# Altium schematic sheet ext_supply.SchDoc: foxBMS BMS-Slave 12-Cell
size A3; DocumentNumber: 18; SheetNumber: 18; SheetTotal: 19; AUTHOR: Fraunhofer IISB foxBMS Team; SheetDescription: External Power Supply
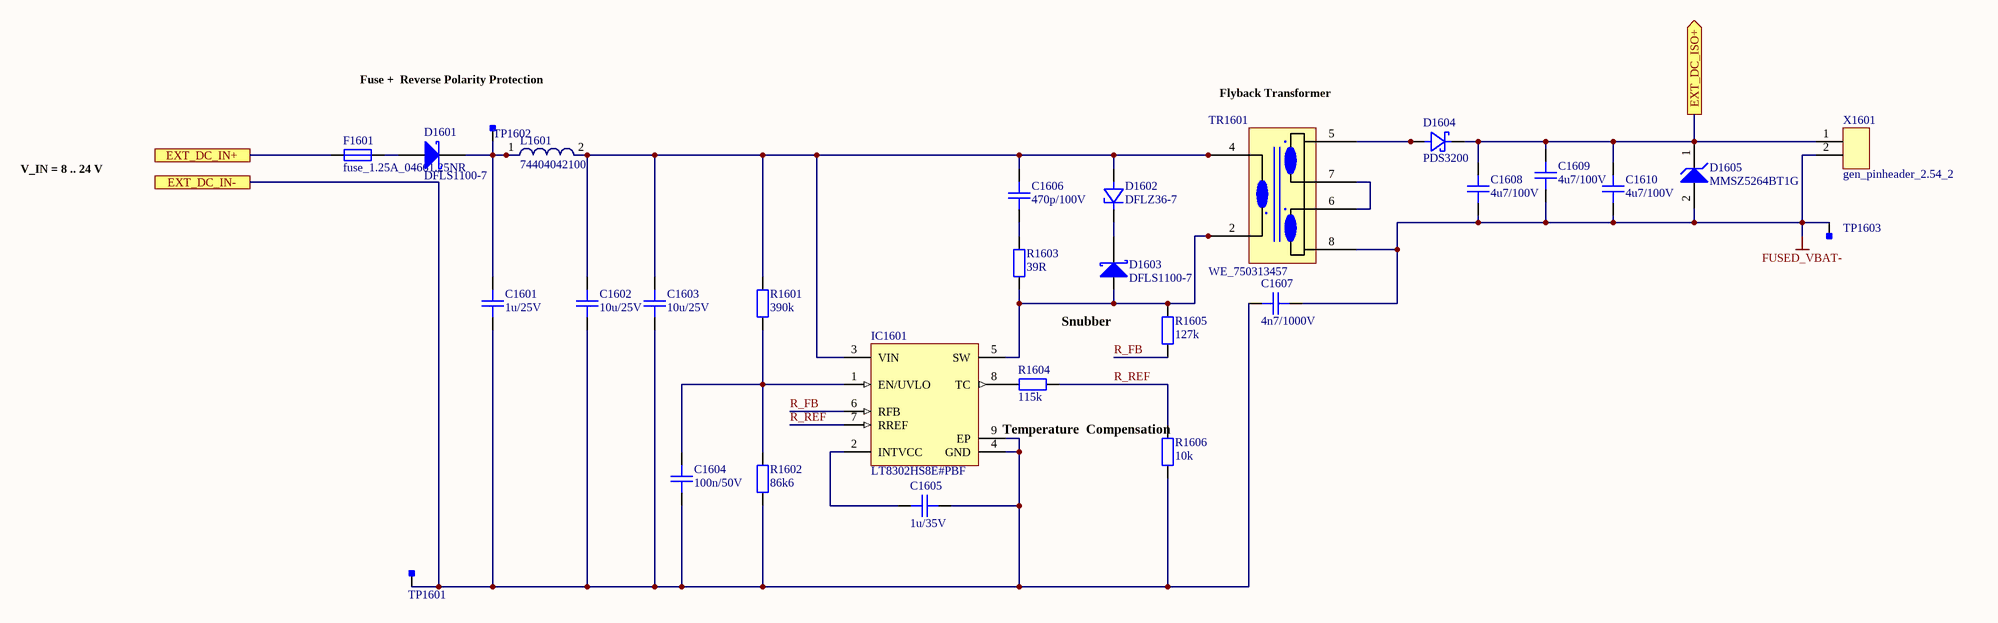
[diagram p0: ext_supply.SchDoc]

## Parts
C1601  1u/25V  [CAPC2012X14N]
C1602  10u/25V  [CAPC3225X25N]
C1603  10u/25V  [CAPC3225X25N]
C1604  100n/50V  [CAPC1608X08N]
C1605  1u/35V  [CAPC1608X08N]
C1606  470p/100V  [CAPC2012X14N]
C1607  4n7/1000V  [CAPC4532X16N]
C1608  4u7/100V  [CAPC3216X18N]
C1609  4u7/100V  [CAPC3216X18N]
C1610  4u7/100V  [CAPC3216X18N]
D1601  DFLS1100-7  [DIOD-POWERDI123-2_V]
D1602  DFLZ36-7  [PowerDI123]
D1603  DFLS1100-7  [DIOD-POWERDI123-2_V]
D1604  PDS3200  [PowerDI5]
D1605  MMSZ5264BT1G  [ONSC-SOD-123-2-425-04_V]
F1601  fuse_1.25A_04661.25NR  [LITTLEFUSE_466]
IC1601  LT8302HS8E#PBF  [LT-S8E-8_V]
L1601  74404042100  [WE-LQS 4018]
R1601  390k  [RESC1608X05N]
R1602  86k6  [RESC1608X05N]
R1603  39R  [RESC2012X05N]
R1604  115k  [RESC1608X05N]
R1605  127k  [RESC1608X05N]
R1606  10k  [RESC1608X05N]
TP1601  Testpoint_Square  [Testpoint_S1]  (value not drawn)  (no BOM)
TP1602  Testpoint_Square  [Testpoint_S1]  (value not drawn)  (no BOM)
TP1603  Testpoint_Square  [Testpoint_S1]  (value not drawn)  (no BOM)
TR1601  WE_750313457  [WE_750313457]
X1601  gen_pinheader_2.54_2  [Pinheader_2.54_2]

## Ports
EXT_DC_IN+, EXT_DC_IN-, EXT_DC_ISO+ (out)

## Nets
FUSED_VBAT-: C1607.2 C1608.1 C1609.1 C1610.1 D1605.2(A) TP1603.1 TR1601.8 X1601.2
EXT_DC_IN+: F1601.1 ; port EXT_DC_IN+
EXT_DC_IN-: C1601.1 C1602.1 C1603.1 C1604.1 C1605.1 C1607.1 IC1601.4(GND) IC1601.9(EP) R1602.1 R1606.1 TP1601.1 ; port EXT_DC_IN-
EXT_DC_ISO+: C1608.2 C1609.2 C1610.2 D1604.1(C) D1605.1(K) X1601.1 ; port EXT_DC_ISO+
R_FB: IC1601.6(RFB) R1605.1
R_REF: IC1601.7(RREF) R1604.2 R1606.2
NetC1601_2: C1601.2 D1601.2(K) L1601.1 TP1602.1
NetC1602_2: C1602.2 C1603.2 C1606.2 D1602.2(A) IC1601.3(VIN) L1601.2 R1601.2 TR1601.3 TR1601.4
NetC1604_2: C1604.2 IC1601.1(EN/UVLO) R1601.1 R1602.2
NetC1605_2: C1605.2 IC1601.2(INTVCC)
NetC1606_1: C1606.1 R1603.2
NetD1601_1: D1601.1(A) F1601.2
NetD1602_1: D1602.1(K) D1603.2(K)
NetD1603_1: D1603.1(A) IC1601.5(SW) R1603.1 R1605.2 TR1601.1 TR1601.2
NetD1604_2: D1604.2(A) D1604.3(A) TR1601.5
NetIC1601_8: IC1601.8(TC) R1604.1
NetTR1601_6: TR1601.6 TR1601.7

## Notes on the sheet
- (near TP1602) Fuse +
  Reverse Polarity Protection
- (near TR1601) Flyback Transformer
- V_IN = 8 .. 24 V
- Snubber
- (near R1606) Temperature
  Compensation
- Fraunhofer IISB
- Schottkystr. 10
- developed by:
- 91058 Erlangen
- Germany
- Author
- Project
- License
- Description
- File
- Version
- Release Date
- Sheet
- www.foxbms.org
- www.iisb.fraunhofer.de
- foxBMS Team
- /

## Library data of the parts
C1601 = gen_C_ceramic_1u_25V_X7R_0805: MLCC; Capacitance: 1u; Rated Voltage: 25V; Dielectric: X7R; Case EIA: 0805; Case Metric: 2012; PnP Package: C_0805_10; PnP Value: 1uF/25V/X7R; PnP equipped: x; Automotive Qualified: False; Part Number: gen_C_ceramic_1u_25V_X7R_0805; Supplier 1: Farnell; Supplier Part Number 1: 2070446
C1602 C1603 = gen_C_ceramic_10u_25V_X7R_1210: MLCC; Capacitance: 10u; Rated Voltage: 25V; Dielectric: X7R; Case EIA: 1210; Case Metric: 3225; AVT Set: x; Automotive Qualified: False; Part Number: gen_C_ceramic_10u_25V_X7R_1210; Supplier 1: Farnell; Supplier Part Number 1: 2070524
C1604 = gen_C_ceramic_100n_50V_X7R_0603: MLCC; Capacitance: 100n; Rated Voltage: 50V; Dielectric: X7R; Case EIA: 0603; Case Metric: 1608; PnP Package: C_0603_10; PnP Value: 100n/50V/X7R; PnP equipped: x; Automotive Qualified: False; Part Number: gen_C_ceramic_100n_50V_X7R_0603; Supplier 1: Farnell; Supplier Part Number 1: 2525267; Supplier 2: Digikey; Supplier Part Number 2: 490-6049-1-ND
C1605 = gen_C_ceramic_1u_35V_X7R_0603: MLCC; Capacitance: 1u; Rated Voltage: 35V; Dielectric: X7R; Case EIA: 0603; Case Metric: 1608; PnP Package: C_0603_10; PnP Value: 1uF/35V/X7R; PnP equipped: x; Automotive Qualified: False; Part Number: gen_C_ceramic_1u_35V_X7R_0603; Supplier 1: Farnell; Supplier Part Number 1: 1907508
C1606 = gen_C_ceramic_470p_100V_X7R_0805: MLCC; Capacitance: 470p; Rated Voltage: 100V; Dielectric: X7R; Case EIA: 0805; Case Metric: 2012; Automotive Qualified: False; Part Number: gen_C_ceramic_470p_100V_X7R_0805; Supplier 1: Farnell; Supplier Part Number 1: 1759283
C1607 = gen_C_ceramic_4n7_1000V_X7R_1812: MLCC; Capacitance: 4n7; Rated Voltage: 1000V; Dielectric: X7R; Case EIA: 1812; Case Metric: 4532; Automotive Qualified: False; Part Number: gen_C_ceramic_4n7_1000V_X7R_1812; Supplier 1: Farnell; Supplier Part Number 1: 1702159
C1608-C1610 = gen_C_ceramic_4u7_100V_X7S_1206: MLCC; Capacitance: 4u7; Rated Voltage: 100V; Dielectric: X7S; Case EIA: 1206; Case Metric: 3216; AVT Set: x; Automotive Qualified: False; Part Number: gen_C_ceramic_4u7_100V_X7S_1206; Supplier 1: Digikey; Supplier Part Number 1: 478-8719-1-ND
D1601 D1603 = CMP-2000-05099-1: 1 A High Voltage Schottky Barrier Rectifier, 0.62 V, -55 to 175 degC, 2- Pin POWERDI123, Pb-Free, Tape and Reel; Manufacturer: Diodes Inc; Average Rectified Current-Max: 1A; Peak Current-Max: 40A; Forward Voltage: 0.77V; Reverse Current-Max: 1µA; Reverse Voltage-Max [Vrrm]: 100V; Datasheet Version: Sep-14; Datasheet URL: https://datasheet.ciiva.com/15144/getdatasheetpartid-44146-15144126.pdf; Manufacturer URL: http://www.diodes.com/
D1602 = DFLZ36-7: Zener Diode 36V; Part Name: DFLZ36; Manufacturer: DIODES Inc; Automotive Qualified: False; Part Number: DFLZ36-7; Operating Temperature: -55°C - +150°C; ComponentLink1Description: Datasheet; ComponentLink1URL: https://www.diodes.com/assets/Datasheets/ds30464.pdf; Supplier 1: Digikey; Supplier Part Number 1: DFLZ36-7DICT-ND
D1604 = PDS3200-13: Schottky Diode 3A 200V 780mV; Manufacturer: DIODES Inc; Automotive Qualified: False; Part Number: PDS3200-13; Part Name: PDS3200; Operating Temperature: -65°C - +150°C; Breakdown Voltage: 200V; Continuous Forward Current: 3A; ComponentLink1Description: Datasheet; ComponentLink1URL: http://www.farnell.com/datasheets/2238298.pdf; Supplier 1: Farnell; Supplier Part Number 1: 1713904
D1605 = CMP-1060-00375-1: Zener Voltage Regulator, 500 mW, 2-Pin SOD-123, Pb-Free, Tape and Reel; Manufacturer: On Semiconductor; VZ Typ (V): 60; P Max (W): 0.5; DatasheetVersion: Rev. 12; PackageReference: SOD-123-2-425-04; Mounting Technology: Surface Mount; ComponentLink3URL: http://www.onsemi.com/pub_link/Collateral/425-04.PDF; ComponentLink1Description: Manufacturer URL; ComponentLink3Description: Package Specification; PartNumber: MMSZ5264BT1G; PackageDescription: 2-Pin SOD, Body 1.6 x 2.69 mm; Packing: Tape and Reel; ComponentLink1URL: http://www.onsemi.com/; RoHS: Pb-Free; ComponentLink2Description: Datasheet; ComponentLink2URL: http://www.onsemi.com/pub_link/Collateral/MMSZ5221BT1-D.PDF; PackageVersion: Rev. G, 10/2009
F1601 = fuse_1.25A_04661.25NR: Fuse, Surface Mount, 466 Series, 1.25 A, 63 VAC, 63 VDC, Very Fast Acting, 1206; Manufacturer: Littlefuse; Automotive Qualified: False; Part Number: fuse_1.25A_04661.25NR; Operating Temperature: -55°C - +90°C; ComponentLink1Description: Datasheet; ComponentLink1URL: http://www.farnell.com/datasheets/1796765.pdf; Supplier 1: Farnell; Supplier Part Number 1: 1596526
IC1601 = CMP-0492-02715-1: Micropower No-Opto Isolated Flyback Converter, 2.8 to 42 V, -40 to 150 degC, 8-Pin SOIC (S8E), RoHS, Tube; PartNumber: LT8302; Output Current: 3.6 A; Number of Outputs: 1; VIN Min: 2.8 V; VIN Max: 42 V; ComponentLink2Description: Datasheet; Temperature Min: -40 degC; PackageDescription: 8-Pin Plastic Small Outline Integrated Circuit Package, Body 4.90 x 3.90 mm, Pitch 1.27 mm; Temperature Max: 150 degC; ComponentLink1URL: http://www.linear.com/; ComponentLink3URL: http://cds.linear.com/docs/en/packaging/05081857_A_S8E.pdf; PackageVersion: Rev. A, 10/2013; Packing: Tube; RoHS: TRUE; DatasheetVersion: Rev. A; ComponentLink2URL: http://cds.linear.com/docs/en/datasheet/8302fa.pdf; Mounting Technology: Surface Mount; ComponentLink1Description: Manufacturer URL; ComponentLink3Description: Package Specification
L1601 = CMP-1354-00028-1: WE-LQS SMD Power Inductor, L=10 µH; Manufacturer: Wuerth Elektronik; Inductance: 10 ÂµH; ComponentLink2URL: http://katalog.we-online.de/pbs/datasheet/74404042100.pdf; PartNumber: 74404042100; ComponentLink2Description: Datasheet; PackageReference: WE-LQS 4018; ComponentLink1URL: http://www.we-online.com; ComponentLink1Description: Manufacturer URL
R1601 = gen_R_390k_0603: SMD Resistor 390k 0603; Tolerance: 1%; Power: 0.1W; Case EIA: 0603; Case Metric: 1608; Maximum Working Voltage: 75V; PnP Package: R_0603; Automotive Qualified: False; Part Number: gen_R_390k_0603; Operating Temperature: -55°C - +155°C; Resistance: 390k; Series: E24; PnP Value: 390k; Supplier 1: Farnell; Supplier Part Number 1: 2303278
R1602 = gen_R_86k6_0603: SMD Resistor 86k6 0603; Tolerance: 1%; Power: 0.1W; Case EIA: 0603; Case Metric: 1608; Maximum Working Voltage: 75V; PnP Package: R_0603; Automotive Qualified: False; Part Number: gen_R_86k6_0603; Operating Temperature: -55°C - +155°C; Resistance: 86k6; Series: E96; PnP Value: 86k6; Supplier 1: Farnell; Supplier Part Number 1: 2059490
R1603 = gen_R_39R_0805: SMD Resistor 39R 0805; Tolerance: 1%; Power: 0.125W; Case EIA: 0805; Case Metric: 2012; Maximum Working Voltage: 150V; PnP Package: R_0805; Automotive Qualified: False; Part Number: gen_R_39R_0805; Operating Temperature: -55°C - +155°C; Resistance: 39R; Series: E24; PnP Value: 39R; Supplier 1: Farnell; Supplier Part Number 1: 1750736
R1604 = gen_R_115k_0603: SMD Resistor 115k 0603; Tolerance: 1%; Power: 0.1W; Case EIA: 0603; Case Metric: 1608; Maximum Working Voltage: 75V; PnP Package: R_0603; Automotive Qualified: False; Part Number: gen_R_115k_0603; Operating Temperature: -55°C - +155°C; Resistance: 115k; Series: E96; PnP Value: 115k; Supplier 1: Farnell; Supplier Part Number 1: 2073367
R1605 = gen_R_127k_0603: SMD Resistor 127k 0603; Tolerance: 1%; Power: 0.1W; Case EIA: 0603; Case Metric: 1608; Maximum Working Voltage: 75V; PnP Package: R_0603; Automotive Qualified: False; Part Number: gen_R_127k_0603; Operating Temperature: -55°C - +155°C; Resistance: 127k; Series: E96; PnP Value: 127k; Supplier 1: Farnell; Supplier Part Number 1: 2059500
R1606 = gen_R_10k_0603: SMD Resistor 10k 0603; Tolerance: 1%; Power: 0.1W; Case EIA: 0603; Case Metric: 1608; Maximum Working Voltage: 75V; PnP Package: R_0603; Automotive Qualified: False; Part Number: gen_R_10k_0603; Operating Temperature: -55°C - +155°C; Resistance: 10k; Series: E24, E96; PnP Value: 10k; Supplier 1: Farnell; Supplier Part Number 1: 2073349
TP1601-TP1603 = Testpoint_Square: Testpoint, square; Part Number: Testpoint_Square
TR1601 = WE_750313457: MID-FLYLT Flyback Transformers for Linear Technology; Manufacturer: Würth Elektronik; Automotive Qualified: False; Part Number: WE_750313457; ComponentLink1Description: Datasheet; ComponentLink1URL: http://katalog.we-online.de/ctm/datasheet/750313457.pdf; ComponentLink2Description: Website; ComponentLink2URL: http://katalog.we-online.de/en/ctm/MID-FLYLT/750313457; Supplier 1: Digikey; Supplier Part Number 1: 1297-1136-1-ND
X1601 = gen_pinheader_2.54_2: Standard Pinheader, THD, gerade, 2.54mm; Circuits: 2; Rated Voltage: 250V; Rated Current: 3A; Automotive Qualified: False; Part Number: gen_pinheader_2.54_2; Part Name: PinHeader; Operating Temperature: −40 °C - +105 °C; Supplier 1: Farnell; Supplier Part Number 1: 2025248